# Altium schematic sheet Revolution.SchDoc: Revolution
size A3; Author: D. Ankers; CompanyName: The OpenPilot Project; DrawnBy: D. Ankers; Engineer: D. Ankers; Organization: The OpenPilot Project; DocumentNumber: 1; Revision: A; SheetNumber: 1; SheetTotal: 1; DocumentName: Revolution; ProjectName: Revolution
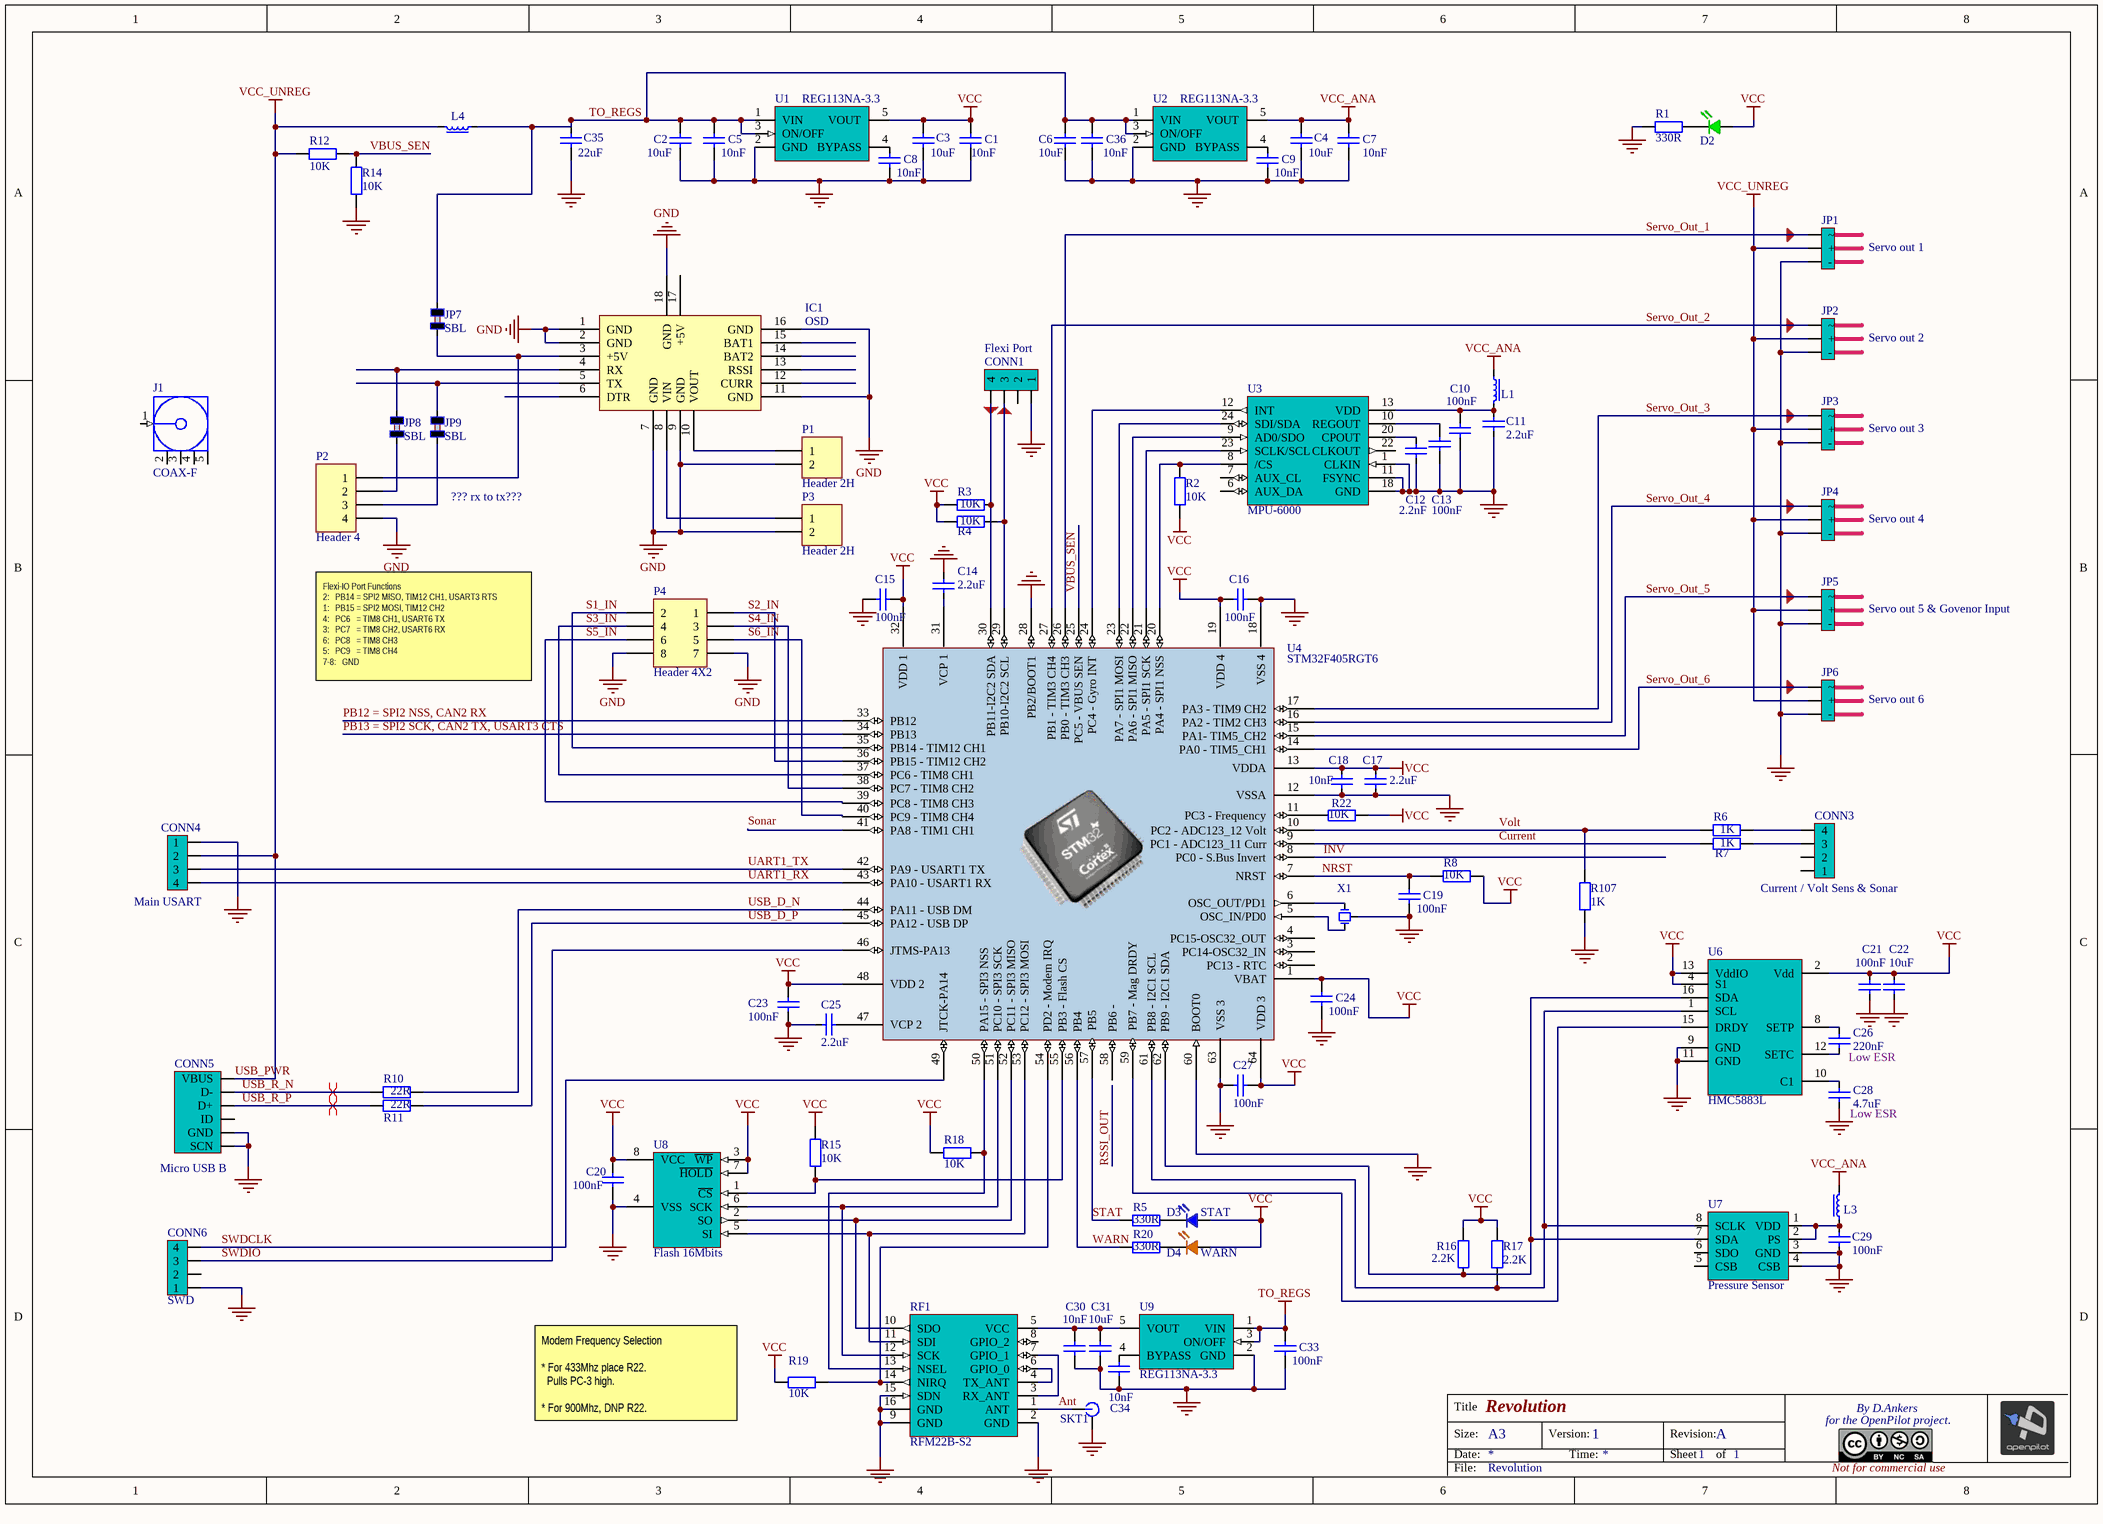
[diagram p0: Revolution.SchDoc]

## Parts
C1  value 10nF  [CAP402N]  (hidden comment: 10n)
C2  value 10uF  [CAP805L]  (hidden comment: Cap805)
C3  value 10uF  [CAP805L]  (hidden comment: Cap805)
C4  value 10uF  [CAP805L]  (hidden comment: Cap805)
C5  value 10nF  [CAP402N]  (hidden comment: 10n)
C6  value 10uF  [CAP805L]  (hidden comment: Cap805)
C7  value 10nF  [CAP402N]  (hidden comment: 10n)
C8  value 10nF  [CAP402N]  (hidden comment: 10n)
C9  value 10nF  [CAP402N]  (hidden comment: 10n)
C10  value 100nF  [CAP402N]  (hidden comment: Cap402)
C11  value 2.2uF  [CAP603L]  (hidden comment: Cap603)
C12  value 2.2nF  [CAP603L]  (hidden comment: Cap603)
C13  value 100nF  [CAP402N]  (hidden comment: Cap402)
C14  value 2.2uF  [CAP603L]  (hidden comment: Cap603)
C15  value 100nF  [CAP402N]  (hidden comment: Cap402)
C16  value 100nF  [CAP402N]  (hidden comment: Cap402)
C17  value 2.2uF  [CAP603L]  (hidden comment: Cap603)
C18  value 10nF  [CAP402N]  (hidden comment: 10n)
C19  value 100nF  [CAP402N]  (hidden comment: Cap402)
C20  value 100nF  [CAP402N]  (hidden comment: Cap402)
C21  value 100nF  [CAP402N]  (hidden comment: Cap402)
C22  value 10uF  [CAP805L]  (hidden comment: Cap805)
C23  value 100nF  [CAP402N]  (hidden comment: Cap402)
C24  value 100nF  [CAP402N]  (hidden comment: Cap402)
C25  value 2.2uF  [CAP603L]  (hidden comment: Cap603)
C26  value 220nF  [CAP603L]  (hidden comment: Cap603)
C27  value 100nF  [CAP402N]  (hidden comment: Cap402)
C28  value 4.7uF  [CAP603L]  (hidden comment: Cap603)
C29  value 100nF  [CAP402N]  (hidden comment: Cap402)
C30  value 10nF  [CAP402N]  (hidden comment: 10n)
C31  value 10uF  [CAP805L]  (hidden comment: Cap805)
C33  value 100nF  [CAP402N]  (hidden comment: Cap402)
C34  value 10nF  [CAP402N]  (hidden comment: 10n)
C35  value 22uF  [CAP805L]  (hidden comment: Cap805)
C36  value 10nF  [CAP402N]  (hidden comment: 10n)
CONN1  Flexi Port  [JST SH 4 Pin Side Entry]
CONN3  Current / Volt Sens & Sonar  [JST SH 4 Pin Side Entry]
CONN4  Main USART  [JST SH 4 Pin Side Entry]
CONN5  Micro USB B  [Micro_USB]
CONN6  SWD  [JST SH 4 Pin Side Entry]
D2  Green  [LED603N]  (value not drawn)
D3  STAT  [LED603N]
D4  WARN  [LED603N]
IC1  OSD  [OSD]
J1  COAX-F  [MCX5.08-H5]
JP1  Servo out 1  [SIP3 - 0.1]
JP2  Servo out 2  [SIP3 - 0.1]
JP3  Servo out 3  [SIP3 - 0.1]
JP4  Servo out 4  [SIP3 - 0.1]
JP5  Servo out 5 & Govenor Input  [SIP3 - 0.1]
JP6  Servo out 6  [SIP3 - 0.1]
JP7  SBL  [TOUCH JMP 2PAD]
JP8  SBL  [TOUCH JMP 2PAD]
JP9  SBL  [TOUCH JMP 2PAD]
L1  FB 300mA  [IND603N]  (value not drawn)
L3  FB 300mA  [IND603N]  (value not drawn)
L4  FB 300mA  [IND603N]  (value not drawn)
P1  Header 2H  [HDR1X2H]
P2  Header 4  [HDR1X4]
P3  Header 2H  [HDR1X2H]
P4  Header 4X2  [HDR2X4]
R1  value 330R  [RES402N]  (hidden comment: Res402)
R2  value 10K  [RES402N]  (hidden comment: Res402)
R3  value 10K  [RES402N]  (hidden comment: Res402)
R4  value 10K  [RES402N]  (hidden comment: Res402)
R5  value 330R  [RES402N]  (hidden comment: Res402)
R6  value 1K  [RES402N]  (hidden comment: Res402)
R7  value 1K  [RES402N]  (hidden comment: Res402)
R8  value 10K  [RES402N]  (hidden comment: Res402)
R10  value 22R  [RES402N]  (hidden comment: Res402)
R11  value 22R  [RES402N]  (hidden comment: Res402)
R12  value 10K  [RES402N]  (hidden comment: Res402)
R14  value 10K  [RES402N]  (hidden comment: Res402)
R15  value 10K  [RES402N]  (hidden comment: Res402)
R16  value 2.2K  [RES402N]  (hidden comment: Res402)
R17  value 2.2K  [RES402N]  (hidden comment: Res402)
R18  value 10K  [RES402N]  (hidden comment: Res402)
R19  value 10K  [RES402N]  (hidden comment: Res402)
R20  value 330R  [RES402N]  (hidden comment: Res402)
R22  value 10K  [RES402N]  (hidden comment: Res402)
R107  value 1K  [RES402N]  (hidden comment: Res402)
RF1  RFM22B-S2  [RFM22-S2]
SKT1  MMCX Thru hole  [MMCX_SOCKET]  (value not drawn)
U1  REG113NA-3.3  [SOT23-5L]
U2  REG113NA-3.3  [SOT23-5L]
U3  MPU-6000  [IMU-3000]
U4  STM32F405RGT6  [STM32 64 Lead]
U6  HMC5883L  [LPCC-16]
U7  Pressure Sensor  [MS5611-01BA03]
U8  Flash 16Mbits  [SOIC8_N]
U9  REG113NA-3.3  [SOT23-5L]
X1  8Mhz Ceralock  [CERALOCK 8Mhz]  (value not drawn)

## Nets
GND: C1.2 C2.2 C3.2 C4.2 C5.2 C6.2 C7.2 C8.2 C9.2 C10.1 C11.2 C12.1 C13.2 C14.1 C15.2 C16.1 C17.1 C18.2 C19.1 C20.1 C21.2 C22.1 C23.2 C24.1 C25.1 C27.2 C28.2 C29.2 C30.2 C31.2 C33.1 C34.2 C35.2 C36.2 CONN1.1 CONN4.1 CONN5.0(SCN) CONN5.5(GND) CONN6.1 IC1.1(GND) IC1.2(GND) IC1.7(GND) IC1.9(GND) IC1.11(GND) IC1.16(GND) IC1.18(GND) JP1.3(-) JP2.3(-) JP3.3(-) JP4.3(-) JP5.3(-) JP6.3(-) P1.2 P2.4 P3.2 P4.7 P4.8 R1.1 R14.1 R107.1 RF1.2(GND) RF1.9(N.C) RF1.15(SDN) RF1.16(GND) SKT1.2(GND) U1.2(GND) U2.2(GND) U3.1(CLKIN) U3.11(FSYNC) U3.18(GND) U4.12(VSSA) U4.18(VSS_4) U4.28(PB2/BOOT1) U4.60(BOOT0) U4.63(VSS_3) U6.9(GND) U6.11(GND) U7.3(GND) U7.4(CSB) U8.4(VSS) U9.2(GND) X1.3
TO_REGS: C2.1 C5.1 C6.1 C33.2 C35.1 C36.1 JP7.2 L4.1 U1.1(VIN) U1.3(ON/OFF) U2.1(VIN) U2.3(ON/OFF) U9.1(VIN) U9.3(ON/OFF)
USB_PWR: CONN4.2 CONN5.1(VBUS) JP1.2(+) JP2.2(+) JP3.2(+) JP4.2(+) JP5.2(+) JP6.2(+) L4.2 R12.1  [also labelled VCC_UNREG]
VCC: C1.1 C3.1 C15.1 C16.2 C17.2 C18.1 C20.2 C21.1 C22.2 C23.1 C24.2 C27.1 D2.2(A) D3.2(A) D4.2(A) R2.1 R3.2 R4.2 R8.2 R15.1 R16.1 R17.1 R18.1 R19.2 R22.1 U1.5(VOUT) U4.1(VBAT) U4.13(VDDA) U4.19(VDD_4) U4.32(VDD_1) U4.48(VDD_2) U4.64(VDD_3) U6.2(Vdd) U6.4(S1) U6.13(VddIO) U8.3(~{WP}) U8.7(~{HOLD}) U8.8(VCC)
VCC_ANA: C4.1 C7.1 L1.1 L3.2 U2.5(VOUT)
Ant: RF1.1(N.C) SKT1.1(PIN)
Current: R7.1 U4.9(PC1_-_ADC123_11_Curr)
INV: U4.8(PC0_-_S.Bus_Invert)
NRST: C19.2 R8.1 U4.7(NRST)
PB12 = SPI2 NSS, CAN2 RX: U4.33(PB12)
PB13 = SPI2 SCK, CAN2 TX, USART3 CTS: U4.34(PB13)
S1_IN: P4.2 U4.35(PB14_-_TIM12_CH1)
S2_IN: P4.1 U4.36(PB15_-_TIM12_CH2)
S3_IN: P4.4 U4.37(PC6_-_TIM8_CH1)
S4_IN: P4.3 U4.38(PC7_-_TIM8_CH2)
S5_IN: P4.6 U4.39(PC8_-_TIM8_CH3)
S6_IN: P4.5 U4.40(PC9_-_TIM8_CH4)
Servo_Out_1: JP1.1 U4.26(PB0_-_TIM3_CH3)
Servo_Out_2: JP2.1 U4.27(PB1_-_TIM3_CH4)
Servo_Out_3: JP3.1 U4.17(PA3_-_TIM9_CH2)
Servo_Out_4: JP4.1 U4.16(PA2_-_TIM2_CH3)
Servo_Out_5: JP5.1 U4.15(PA1-_TIM5_CH2)
Servo_Out_6: JP6.1 U4.14(PA0_-_TIM5_CH1)
Sonar: U4.41(PA8_-_TIM1_CH1)
STAT: R5.2 U4.57(PB5)
SWDCLK: CONN6.4 U4.49(JTCK-PA14)
SWDIO: CONN6.3 U4.46(JTMS-PA13)
UART1_RX: CONN4.4 U4.43(PA10_-_USART1_RX)
UART1_TX: CONN4.3 U4.42(PA9_-_USART1_TX)
USB_D_N: R10.1 U4.44(PA11_-_USB_DM)
USB_D_P: R11.1 U4.45(PA12_-_USB_DP)
USB_R_N: CONN5.2(D-) R10.2
USB_R_P: CONN5.3(D+) R11.2
VBUS_SEN: R12.2 R14.2 U4.25(PC5_-_VBUS_SEN)
Volt: R6.1 R107.2 U4.10(PC2_-_ADC123_12_Volt)
WARN: R20.2 U4.56(PB4)
NetC8_1: C8.1 U1.4(BYPASS)
NetC9_1: C9.1 U2.4(BYPASS)
NetC10_2: C10.2 C11.1 L1.2 U3.13(VDD)
NetC12_2: C12.2 U3.20(CPOUT)
NetC13_1: C13.1 U3.10(REGOUT)
NetC14_2: C14.2 U4.31(VCP_1)
NetC25_2: C25.2 U4.47(VCP_2)
NetC26_1: C26.1 U6.12(SETC)
NetC26_2: C26.2 U6.8(NC)
NetC28_1: C28.1 U6.10(C1)
NetC29_1: C29.1 L3.1 U7.1(VDD) U7.2(PS)
NetC30_1: C30.1 C31.1 RF1.5(VCC) U9.5(VOUT)
NetC34_1: C34.1 U9.4(BYPASS)
NetCONN1_3: CONN1.3 R4.1 U4.29(PB10-I2C2_SCL)
NetCONN1_4: CONN1.4 R3.1 U4.30(PB11-I2C2_SDA)
NetCONN3_3: CONN3.3 R7.2
NetCONN3_4: CONN3.4 R6.2
NetD2_1: D2.1(K) R1.2
NetD3_1: D3.1(K) R5.1
NetD4_1: D4.1(K) R20.1
NetIC1_3: IC1.3(+5V) JP7.1 P2.1
NetIC1_4: IC1.4(RX) JP8.2
NetIC1_5: IC1.5(TX) JP9.2
NetIC1_8: IC1.8(VIN) P3.1
NetIC1_10: IC1.10(VOUT) P1.1
NetJP8_1: JP8.1 P2.2
NetJP9_1: JP9.1 P2.3
NetR2_2: R2.2 U3.8(/CS) U4.20(PA4_-_SPI1_NSS)
NetR15_2: R15.2 U4.55(PB3_-_Flash_CS) U8.1(~{CS})
NetR16_2: R16.2 U4.62(PB9_-_I2C1_SDA) U6.16(SDA) U7.7(SDA)
NetR17_2: R17.2 U4.61(PB8_-_I2C1_SCL) U6.1(SCL) U7.8(SCLK)
NetR18_2: R18.2 RF1.13(NSEL) U4.50(PA15_-_SPI3_NSS)
NetR19_1: R19.1 RF1.14(N.C) U4.54(PD2_-_Modem_IRQ)
NetR22_2: R22.2 U4.11(PC3_-_Frequency)
NetRF1_3: RF1.3(RX_ANT) RF1.7(GPIO_1)
NetRF1_4: RF1.4(N.C) RF1.6(GPIO_0)
NetRF1_10: RF1.10(SDO) U4.52(PC11_-_SPI3_MISO) U8.2(SO)
NetRF1_11: RF1.11(SDI) U4.53(PC12_-_SPI3_MOSI) U8.5(SI)
NetRF1_12: RF1.12(SCK) U4.51(PC10_-_SPI3_SCK) U8.6(SCK)
NetU3_9: U3.9(AD0/SDO) U4.22(PA6_-_SPI1_MISO)
NetU3_12: U3.12(INT) U4.24(PC4_-_Gyro_INT)
NetU3_23: U3.23(SCLK/SCL) U4.21(PA5_-_SPI1_SCK)
NetU3_24: U3.24(SDI/SDA) U4.23(PA7_-_SPI1_MOSI)
NetU4_5: U4.5(OSC_IN/PD0) X1.1
NetU4_6: U4.6(OSC_OUT/PD1) X1.2
NetU4_59: U4.59(PB7_-_Mag_DRDY) U6.15(DRDY)

Not connected (* = marked no-connect by the designer): CONN1 2; CONN3 1 2; CONN5 4(ID); CONN6 2; IC1 6(DTR) 12(CURR) 13(RSSI) 14(BAT2) 15(BAT1) 17(+5V); J1 1(Signal) 2(GND) 3(GND) 4(GND) 5(GND); RF1 8(N.C); U3 2(NC) 3(NC) 4(NC) 5(NC) 6(AUX_DA) 7(AUX_CL) 14(NC) 15(NC) 16(NC) 17(NC) 19(RESV) 21(RESV) 22(CLKOUT); U4 2(PC13_-_RTC) 3(PC14-OSC32_IN) 4(PC15-OSC32_OUT) 58(PB6_-); U6 3(NC) 5(NC) 6(NC) 7(NC) 14(NC); U7 5(CSB) 6(SDO)

## Layout directives
differential pair: USB_R_N, USB_R_P

## Notes on the sheet
- ??? rx to tx???
- Flexi-IO Port Functions
  2:   PB14 = SPI2 MISO, TIM12 CH1, USART3 RTS
  1:   PB15 = SPI2 MOSI, TIM12 CH2
  4:   PC6   = TIM8 CH1, USART6 TX
  3:   PC7   = TIM8 CH2, USART6 RX
  6:   PC8   = TIM8 CH3
  5:   PC9   = TIM8 CH4
  7-8:   GND
- (near C26) Low ESR
- (near C28) Low ESR
- (near R19) Modem Frequency Selection
  * For 433Mhz place R22.
  Pulls PC-3 high.
  * For 900Mhz, DNP R22.
- Title
- Size:
- Date:
- A3
- Version:
- Time:
- Revision:
- Sheet
- of
- for the OpenPilot project.
- By D.Ankers
- File:
- Not for commercial use

## Library data of the parts
C1 C5 C7-C10 C13 C15 C16 C18-C21 C23 C24 C27 C29 C30 C33 C34 C36 = Cap402: Capacitor SMD; Publisher: The OpenPilot Project; Published: 1-Nov-2010; LatestRevisionDate: 1-Nov-2010; LatestRevisionNote: Released OpenPilot Lib; PackageReference: 0402 (1005 Metric); ComponentLink2Description: Datasheet; Supplier 1: Digi-Key
  C1 C5 C7-C9 C18 C30 C34 C36: Supplier Part Number 1: 587-1223-1-ND
  C10 C13 C15 C16 C19-C21 C23 C24 C27 C29 C33: Supplier Part Number 1: 445-4952-1-ND
C2-C4 C6 C22 C31 C35 = Cap805: Capacitor SMD; Published: 1-Nov-2010; LatestRevisionDate: 1-Nov-2010; LatestRevisionNote: Released OpenPilot Lib; PackageReference: 0805 (2012 Metric); Publisher: The OpenPilot Project; Supplier 1: Digi-Key
  C2-C4 C6 C22 C31: Supplier Part Number 1: 490-3886-1-ND
  C35: Supplier Part Number 1: 587-1958-1-ND
C11 C12 C14 C17 C25 C26 C28 = Cap603: Capacitor SMD; Published: 1-Nov-2010; LatestRevisionDate: 1-Nov-2010; LatestRevisionNote: Released OpenPilot Lib; PackageReference: 0603 (1608 Metric); Publisher: The OpenPilot Project; Supplier 1: Digi-Key
  C11 C14 C17 C25: Supplier Part Number 1: 445-5175-1-ND
  C12: Supplier Part Number 1: 445-1309-1-ND
  C26: Supplier Part Number 1: 445-1318-1-ND
  C28: Supplier Part Number 1: 445-5178-1-ND
CONN1 CONN3 CONN4 CONN6 = JST-SH 4-pin Side Entry Socket: Manufacturer: Generic Components; Class: Connector; Supplier 1: Digi-Key; Supplier Part Number 1: 455-1804-1-ND
CONN5 = USB Micro B SMT: USB Micro B SMT Socket; Class: Connector; ComponentLink2Description: Datasheet; LatestRevisionDate: 1-Nov-2010; LatestRevisionNote: Released OpenPilot Lib; Published: 1-Nov-2010; Publisher: The OpenPilot Project; Supplier 1: Digi-Key; Supplier Part Number 1: WM17141CT-ND
D2 = LED 603 Gr: Green 603 LED; Value: 2.1v 20mA; Supplier 1: Digi-Key; Supplier Part Number 1: 754-1116-1-ND
D3 = LED 603 Bl: Blue 603 LED; Supplier 1: Digi-Key; Supplier Part Number 1: 350-2037-1-ND
D4 = LED 603 Or: Orange 603 LED; Value: 2.1v 20mA; Supplier 1: Digi-Key; Supplier Part Number 1: 754-1120-1-ND
J1 = COAX-F: RF Coaxial PCB Connector, MCX; Thru-Hole, Right-Angle Mount Socket, Blunt Post Terminal, 50 Ohm Impedance; PCB_Layout: Complies with manufacturer's recommendation.; DrillSize: Corresponds to nominal value.; Published: 15-Jul-2004; LatestRevisionDate: 15-Jul-2004; LatestRevisionNote: Component Replaced.; DatasheetDocument: 30-May-2003; PackageDocument: 04-Jul-1999; PackageReference: 919-119J-51AX; Publisher: Altium Limited; ComponentLink1Description: Manufacturer Link; ComponentLink1URL: http://www.amphenolrf.com/
JP1-JP6 = Hdr 3 Pin 0.1: Header, 3-Pin, 0.1"; Manufacturer: Generic Components; Class: Connector; Supplier 1: Digi-Key; Supplier Part Number 1: MTLW-103-23-S-S-260-ND
JP7-JP9 = 2 PAD Touch JMP: 2 Pad Touch Jumper; LatestRevisionDate: 1-Nov-2010; LatestRevisionNote: Released OpenPilot Lib; Published: 1-Nov-2010; Publisher: The OpenPilot Project
L1 L3 L4 = FerriteBead 300mA: Ferrite Bead 300mA; Manufacturer: Generic Components; Class: Passive; Supplier 1: Digi-Key; Supplier Part Number 1: 732-1586-1-ND; ComponentLink2Description: Datasheet; LatestRevisionDate: 1-Nov-2010; LatestRevisionNote: Released OpenPilot Lib; Published: 1-Nov-2010; Publisher: The OpenPilot Project
P1 P3 = Header 2H: Header, 2-Pin, Right Angle; LatestRevisionDate: 17-Jul-2002; LatestRevisionNote: Re-released for DXP Platform.; Publisher: Altium Limited
P2 = Header 4: Header, 4-Pin; LatestRevisionDate: 17-Jul-2002; LatestRevisionNote: Re-released for DXP Platform.; Publisher: Altium Limited
P4 = Header 4X2: Header, 4-Pin, Dual row; LatestRevisionDate: 17-Jul-2002; LatestRevisionNote: Re-released for DXP Platform.; Publisher: Altium Limited
R1-R8 R10-R12 R14-R20 R22 R107 = Res402: Resistor SMD; Published: 1-Nov-2010; LatestRevisionDate: 1-Nov-2010; LatestRevisionNote: Released OpenPilot Lib; PackageReference: 0402 ( 1005 Metric); Publisher: The OpenPilot Project; ComponentLink2Description: Datasheet; Supplier 1: Digi-Key
  R1 R5 R20: Supplier Part Number 1: P330LCT-ND
  R2-R4 R8 R12 R14 R15 R18 R19 R22: Supplier Part Number 1: P10.0KLCT-ND
  R6 R7 R107: Supplier Part Number 1: P1.00KLCT-ND
  R10 R11: Supplier Part Number 1: P22.0LCT-ND
  R16 R17: Supplier Part Number 1: P2.20KLCT-ND
RF1 = RFM22B-S2: UHF 100mW Transceiver
SKT1 = MMCX Thru hole: MMCX Socket; Supplier 1: Digi-Key; Supplier Part Number 1: ARF1729-ND
U1 U2 U9 = REG113NA-3.3: 3.3V 400mA LDO Regulator; Supplier 1: Digi-Key; Supplier Part Number 1: REG113NA-3.3/3KCT-ND
U3 = MPU-3/6000: Invensense MPU-3/6000,  3-axis Gyros & Accel on 6000; ComponentLink2Description: Datasheet; LatestRevisionDate: 1-Nov-2010; LatestRevisionNote: Released OpenPilot Lib; Published: 1-Nov-2010; Publisher: The OpenPilot Project; Manufacturer: Invensense; Supplier 1: Invensense; Supplier Part Number 1: MPU-6000
U4 = STM32F103RET6: STM32 ARM-based 32-bit MCU with 1MB Flash, 64-pin LQFP, Industrial Temperature; Supplier 1: Digi-Key; Supplier Part Number 1: 497-11767-ND
U6 = HMC5883L: IC, Magnetometer, 3 axis, +/- 8 Oe, I2C, 160Hz; Manufacturer: Honeywell; Supplier 1: Digi-Key; Supplier Part Number 1: 342-1082-1-ND; ComponentLink2Description: Datasheet; LatestRevisionDate: 13 Jan 2011; LatestRevisionNote: Initial version; Published: 13 Jan 2011; Publisher: The OpenPilot Project; ManufacturerPartNo: HMC5883L; Value: HMC5883L
U7 = MS5611-01BA03: Pressure Sensor - MS5611-01BA03
U8 = Flash 16Mb 75MHZ 8SOIC: 16Mbit SPI Flash Memory; ComponentLink2Description: Datasheet; LatestRevisionDate: 1-Nov-2010; LatestRevisionNote: Released OpenPilot Lib; Published: 1-Nov-2010; Publisher: The OpenPilot Project; Supplier 1: Digi-Key; Supplier Part Number 1: M25P16-VMN6P-ND
X1 = CERALOCK8: Ceralock 8Mhz with caps; Class: Oscillator; SubClass: Ceramic Oscillator; ComponentLink2Description: Datasheet; LatestRevisionDate: 1-Nov-2010; LatestRevisionNote: Released OpenPilot Lib; Published: 1-Nov-2010; Publisher: The OpenPilot Project; Supplier 1: Digi-Key; Supplier Part Number 1: 490-1195-1-ND